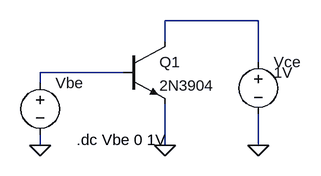
[diagram p0: schematic ce-input.asc]
ce-input.asc, the LTspice schematic file:
Version 4
SHEET 1 880 680
WIRE 368 32 224 32
WIRE 224 64 224 32
WIRE 368 96 368 32
WIRE 160 112 32 112
WIRE 32 128 32 112
WIRE 32 224 32 208
WIRE 224 224 224 160
WIRE 368 224 368 176
FLAG 224 224 0
FLAG 32 224 0
FLAG 368 224 0
SYMBOL voltage 32 112 R0
WINDOW 3 24 32 Left 2
WINDOW 123 0 0 Left 2
WINDOW 39 0 0 Left 2
SYMATTR Value ""
SYMATTR InstName Vbe
SYMBOL npn 160 64 R0
SYMATTR InstName Q1
SYMATTR Value 2N3904
SYMBOL voltage 368 80 R0
WINDOW 3 24 32 Left 2
WINDOW 123 0 0 Left 2
WINDOW 39 0 0 Left 2
SYMATTR Value 1V
SYMATTR InstName Vce
TEXT 88 216 Left 2 !.dc Vbe 0 1V

The netlist it stands for:
* ce-input.asc
Vbe N002 0
Q1 N001 N002 0 0 2N3904
Vce N001 0 1V
.model NPN NPN
.model PNP PNP
.lib standard.bjt
.dc Vbe 0 1V
.backanno
.end